# EAGLE design carteArduino (EAGLE 6.3)
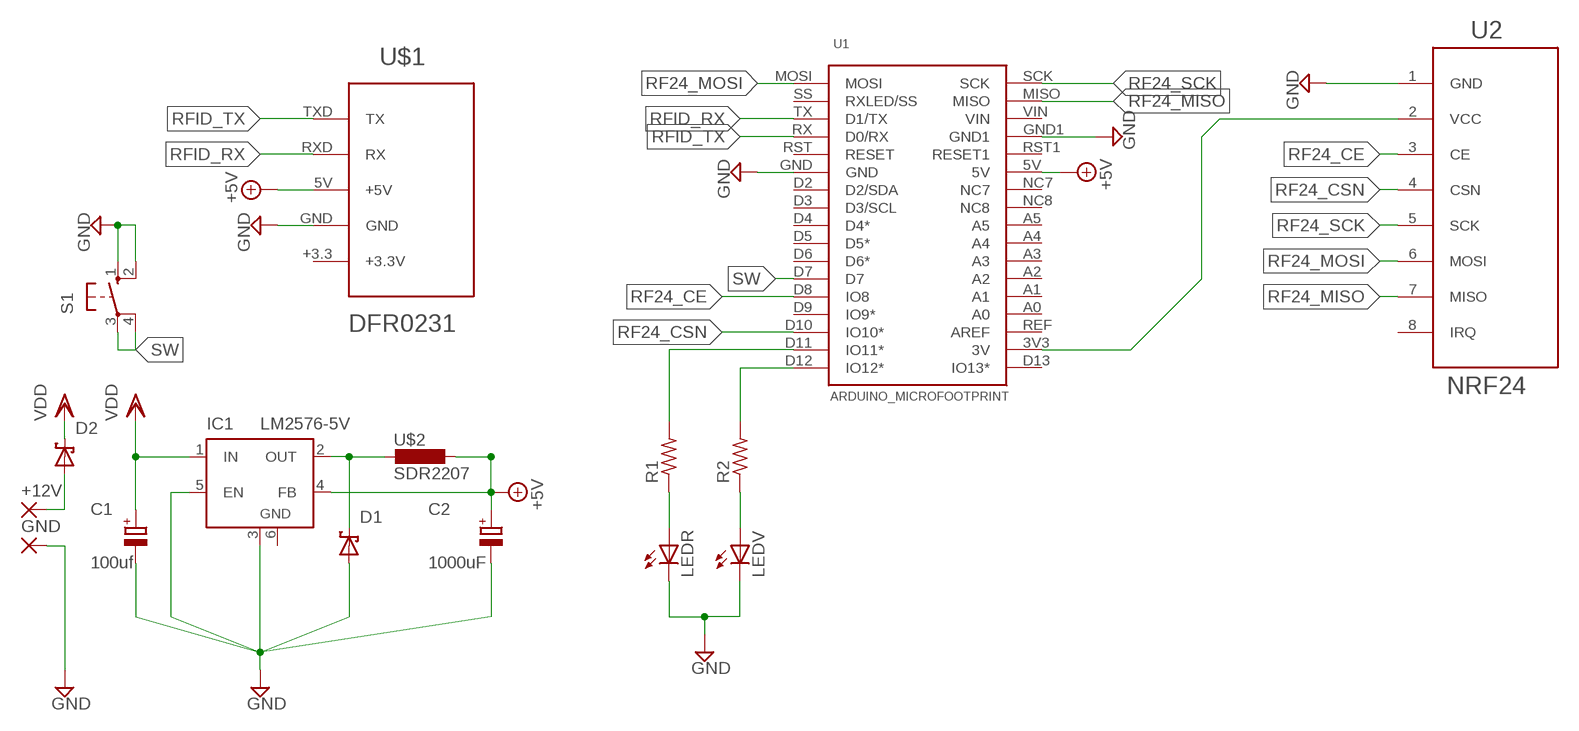
[diagram p0: schematic, sheet 1]

## Parts
+12V  3,81/1,4  [3,81/1,4]
C1  100uf  CPOL-EUE  [PANASONIC_E]
C2  1000uF  CPOL-EUG  [PANASONIC_G]
D1  SCHOTTKY-DIODESMC  [SMC]
D2  SCHOTTKY-DIODESMC  [SMC]
GND  3,81/1,4  [3,81/1,4]
IC1  LM2576-5V  LM2596S  [TO263-5]
LEDR  LED3MM  [LED3MM]
LEDV  LED3MM  [LED3MM]
R1  R-US_R1206  [R1206]
R2  R-US_R1206  [R1206]
S1  40-XX  [B3F-40XX]
U1  ARDUINO_MICROFOOTPRINT  [ARDUINO-MICRO]
U2  NRF24  [NRF_24_8PIN]
U$1  DFR0231  [DFR0231_5PIN_HOLES]
U$2  SDR2207  [SM]

## Nets
+5V: C2.+ IC1.4(FB) U1.5V U$1.5V(+5V) U$2.P$2
GND: C1.- C2.- D1.A GND.1(P) IC1.3(GND) IC1.5(EN) LEDR.K(C) LEDV.K(C) S1.1(S) S1.2(S1) U1.GND U1.GND1 U2.1(GND) U$1.GND
N$1: LEDR.A R1.1
N$2: LEDV.A R2.1
N$3: D1.C IC1.2(OUT) U$2.P$1
N$4: R2.2 U1.D12(IO12*)
N$5: R1.2 U1.D11(IO11*)
N$6: +12V.1(P) D2.A
N$7: U1.3V3(3V) U2.2(VCC)
RF24_CE: U1.D8(IO8) U2.3(CE)
RF24_CSN: U1.D10(IO10*) U2.4(CSN)
RF24_MISO: U1.MISO U2.7(MISO)
RF24_MOSI: U1.MOSI U2.6(MOSI)
RF24_SCK: U1.SCK U2.5(SCK)
RFID_RX: U1.TX(D1/TX) U$1.RXD(RX)
RFID_TX: U1.RX(D0/RX) U$1.TXD(TX)
SW: S1.3(P) S1.4(P1) U1.D7
VDD: C1.+ D2.C IC1.1(IN)
Unconnected: U1.A0 U1.A1 U1.A2 U1.A3 U1.A4 U1.A5 U1.D2(D2/SDA) U1.D3(D3/SCL) U1.D4(D4*) U1.D5(D5*) U1.D6(D6*) U1.D9(IO9*) U1.D13(IO13*) U1.NC7 U1.NC8 U1.REF(AREF) U1.RST1(RESET1) U1.RST(RESET) U1.SS(RXLED/SS) U1.VIN U2.8(IRQ) U$1.+3.3(+3.3V)

## Power pins joined to a net without a drawn wire
GND: IC1.6(GND)

## Library data of the parts
+12V GND = wirepad:3,81/1,4: THROUGH-HOLE PAD
C1 C2 = rcl:CPOL-EU: POLARIZED CAPACITOR, European symbol
D1 D2 = diode:SCHOTTKY-DIODE: Schottky Diode
IC1 = linear:LM2596S: STEP-DOWN VOLTAGE REGULATOR
LEDR LEDV = adafruit:LED: LED OSRAM: - CHIPLED LG R971, LG N971, LY N971, LG Q971, LY Q971, LO R971, LY R971 LH N974, LH R974 LS Q976, LO Q976, LY Q976 LO Q996 - Hyper CHIPLED LW Q18S LB Q993, LB Q99A, LB R99A - SideLED LS A670, LO A670, LY A670, LG A670, LP A670 LB A673, LV A673, LT A673, LW A673 LH A674 LY A675 LS A676, LA A676, LO A676, LY A676, LW A676 LS A679, LY A679, LG A679 - Hyper Micro SIDELED® LS Y876, LA Y876, LO Y876, LY Y876 LT Y87S - SmartLED LW L88C, LW L88S LB L89C, LB L89S, LG L890 LS L89K, LO L89K, LY L89K LS L896, LA L896, LO L896, LY L896 - TOPLED LS T670, LO T670, LY T670, LG T670, LP T670 LSG T670, LSP T670, LSY T670, LOP T670, LYG T670 LG T671, LOG T671, LSG T671 LB T673, LV T673, LT T673, LW T673 LH T674 LS T676, LA T676, LO T676, LY T676, LB T676, LH T676, LSB T676, LW T676 LB T67C, LV T67C, LT T67C, LS T67K, LO T67K, LY T67K, LW E67C LS E67B, LA E67B, LO E67B, LY E67B, LB E67C, LV E67C, LT E67C LW T67C LS T679, LY T679, LG T679 LS T770, LO T770, LY T770, LG T770, LP T770 LB T773, LV T773, LT T773, LW T773 LH T774 LS E675, LA E675, LY E675, LS T675 LS T776, LA T776, LO T776, LY T776, LB T776 LHGB T686 LT T68C, LB T68C - Hyper Mini TOPLED® LB M676 - Mini TOPLED Santana® LG M470 LS M47K, LO M47K, LY M47K Source: http://www.osram.convergy.de/
R1 R2 = adafruit (2):R-US_: RESISTOR, American symbol
S1 = adafruit:40-XX: OMRON SWITCH; MF: OMRON COMPONENTS USA; MPN: B3F-4000; OC_FARNELL: 176434; OC_NEWARK: 36K3105
U1 = arduino-micro:ARDUINO_MICRO
U2 = lib:NRF24
U$1 = lib:DFR0231
U$2 = bourns-inductor:SDR2207

## Board
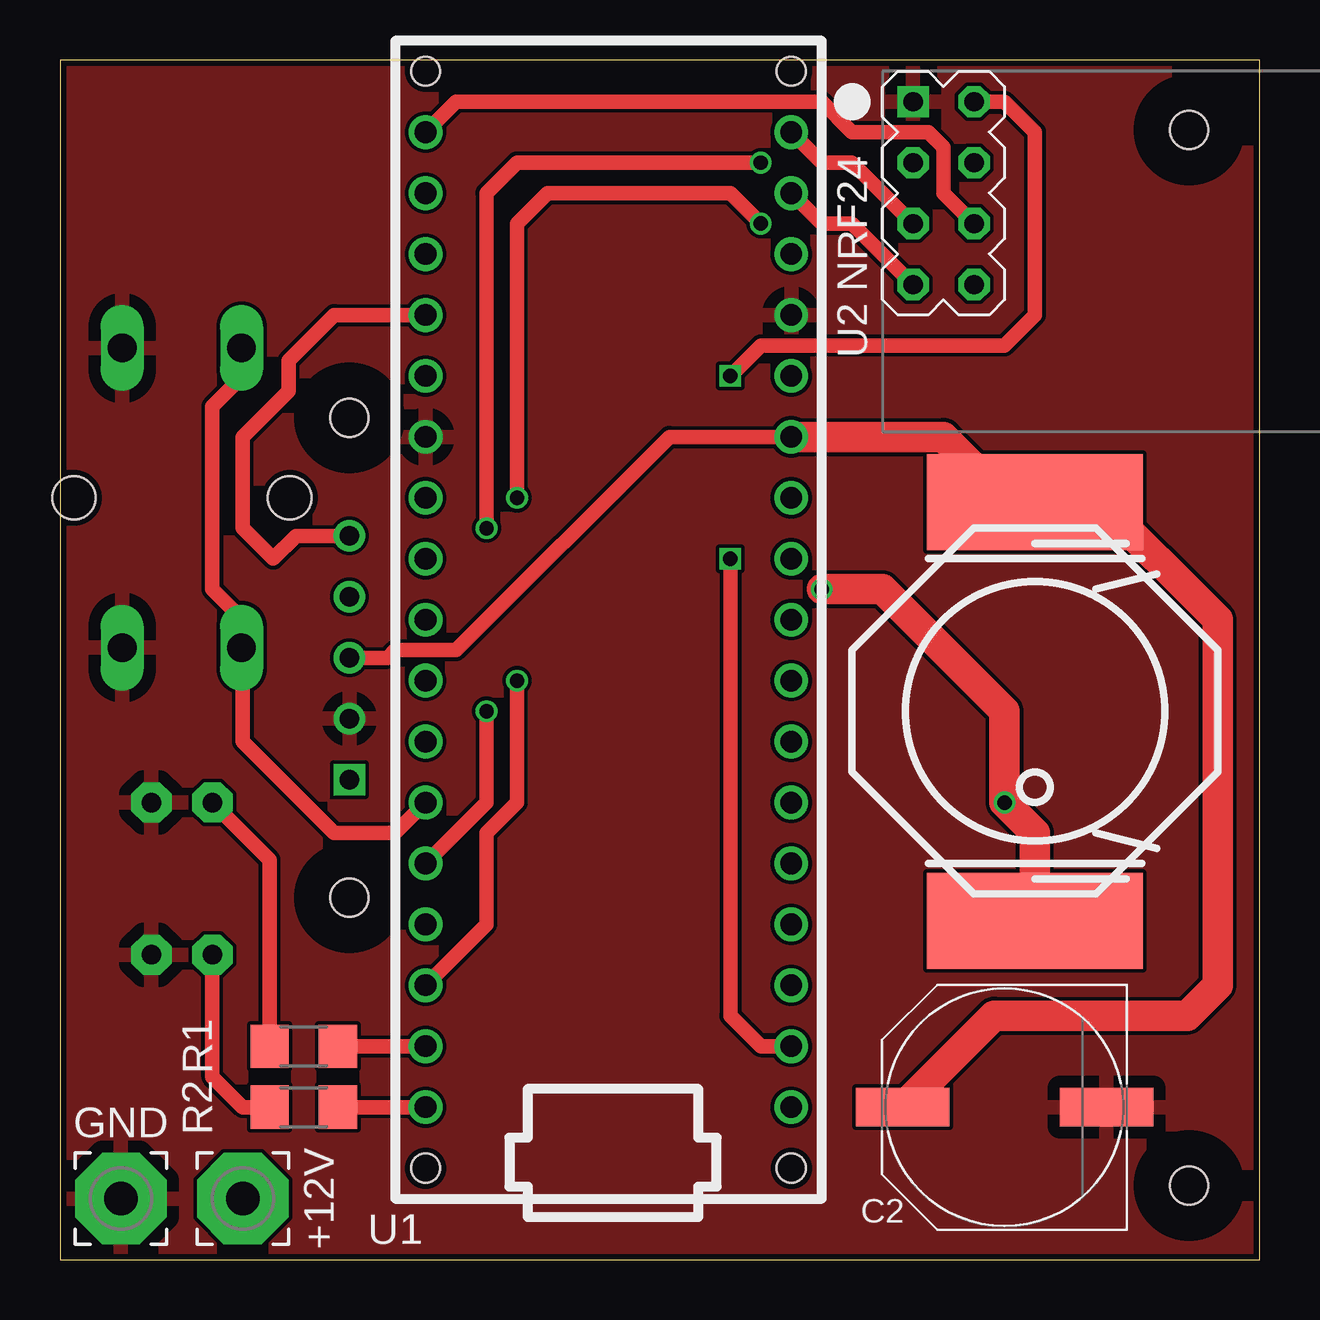
[diagram p1: board, top side]
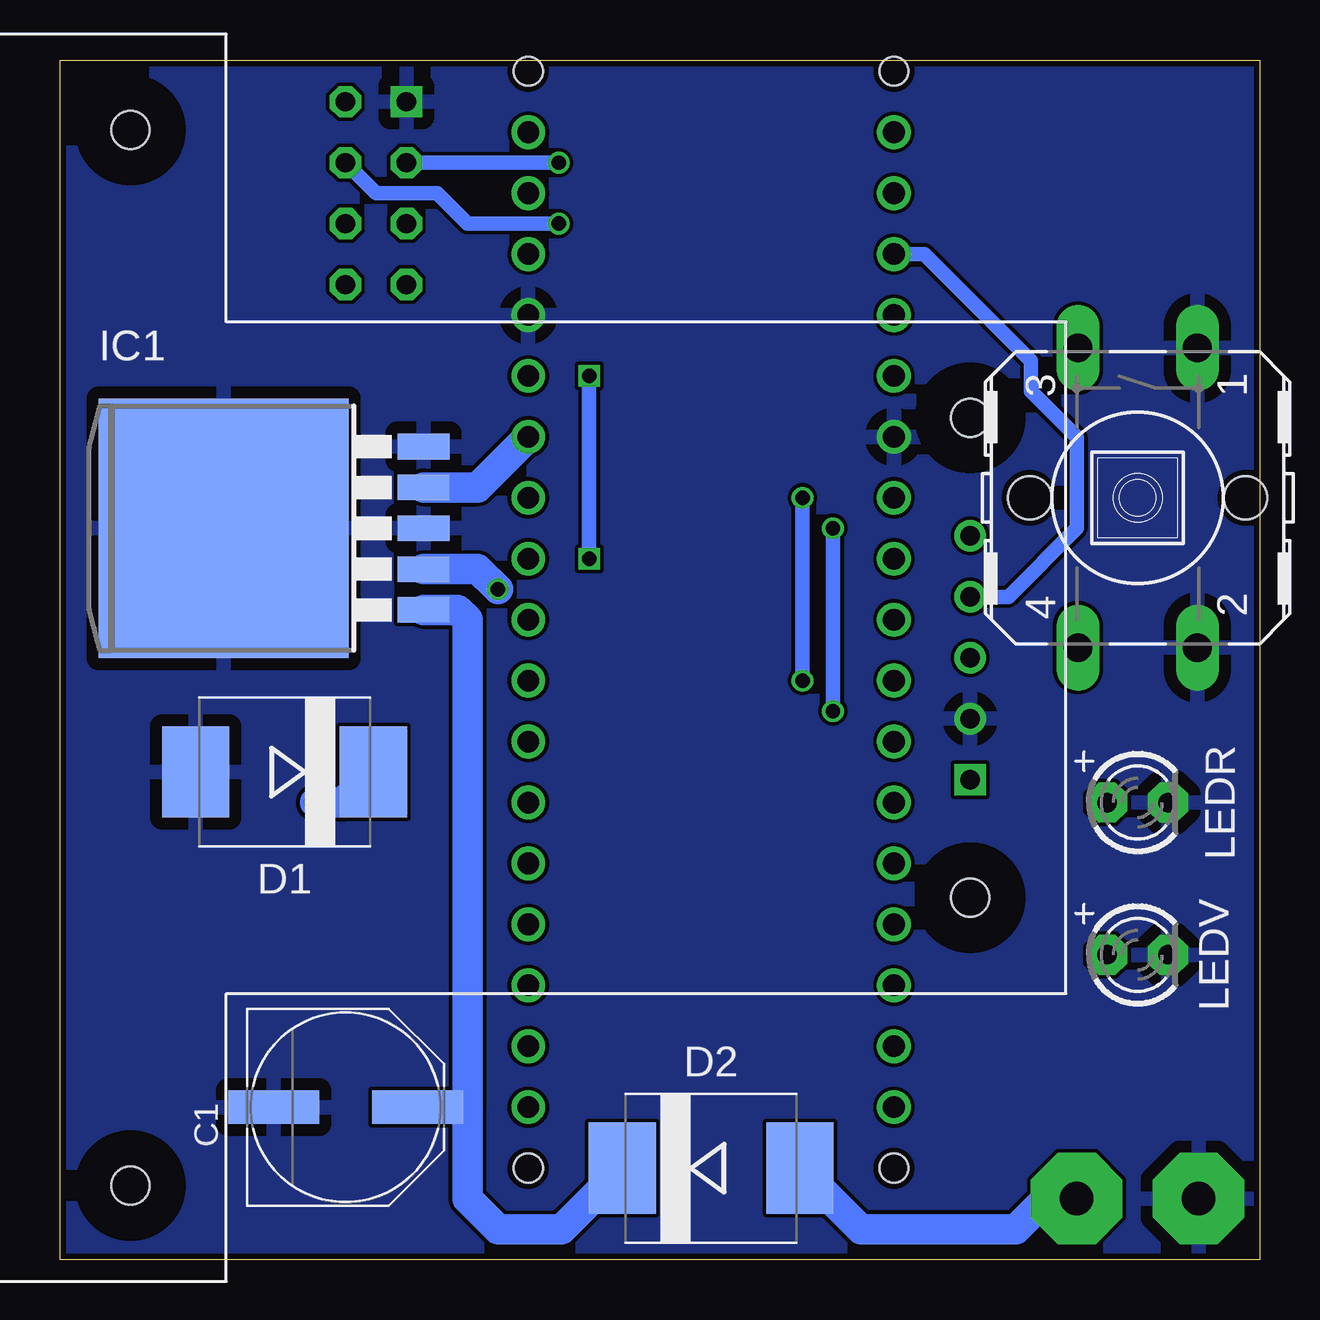
[diagram p2: board, bottom side, seen from below]

Size 50 x 50 mm. Coordinates in mm from the lower left corner, seen from the top.
Outline: 0,0 50,0 50,50 0,50 0,0
Copper layers (1*16): Top 0.035mm / dielectric 1.5mm / Bottom 0.035mm
Design rules "ITEADstudio_DRC_restrict": minimum track width 6mil, minimum drill 12mil, track to track 6mil, track to pad 6mil, pad to pad 6mil, via to via 6mil, smd to smd 0mil, copper to edge 10mil, drill to drill 10mil, minimum pad ring 10mil, minimum via ring 6mil, stop-mask expansion 2mil, vias tented up to drill 100mil, thermal gap 20mil

### Footprints (pad centres in the part's own frame; a part is rotated, then mirrored left to right if it is on the bottom)
3,81/1,4 = drill 1.397 pad 3.81 octagon: 1 0,0
PANASONIC_E = smd 3.8 x 1.4: + 3,0; - -3,0
PANASONIC_G = smd 3.9 x 1.6: + 4.25,0; - -4.25,0
SMC = smd 2.8 x 3.8: A 3.7,0; C -3.7,0
TO263-5 = smd 1.067 x 2.159: 1 -3.404,-5.791; 2 -1.702,-5.791; 3 0,-5.791; 4 1.702,-5.791; 5 3.404,-5.791 | smd 10.8 x 10.41: 6 0,2.54
LED3MM = drill 0.813 pad 1.676 octagon: A -1.27,0; K 1.27,0
R1206 = smd 1.6 x 1.803: 1 -1.422,0; 2 1.422,0
B3F-40XX = drill 1.194 long: 1 -6.248,2.489; 2 6.248,2.489; 3 -6.248,-2.489; 4 6.248,-2.489 | hole 1.803: 0,-4.496; 0,4.496
ARDUINO-MICRO = drill 0.9: 3V3 16.51,3.81; 5V 16.51,29.21; A0 16.51,8.89; A1 16.51,11.43; A2 16.51,13.97; A3 16.51,16.51; A4 16.51,19.05; A5 16.51,21.59; D2 1.27,26.67; D3 1.27,24.13; D4 1.27,21.59; D5 1.27,19.05; D6 1.27,16.51; D7 1.27,13.97; D8 1.27,11.43; D9 1.27,8.89; D10 1.27,6.35; D11 1.27,3.81; D12 1.27,1.27; D13 16.51,1.27; GND 1.27,29.21; GND1 16.51,34.29; MISO 16.51,39.37; MOSI 1.27,41.91; NC7 16.51,26.67; NC8 16.51,24.13; REF 16.51,6.35; RST 1.27,31.75; RST1 16.51,31.75; RX 1.27,34.29; SCK 16.51,41.91; SS 1.27,39.37; TX 1.27,36.83; VIN 16.51,36.83 | hole 1.2: 1.27,-1.27; 16.51,-1.27; 1.27,44.45; 16.51,44.45
NRF_24_8PIN = drill 0.8 square: 1 1.27,-3.81 | drill 0.8 octagon: 2 -1.27,-3.81; 3 1.27,-1.27; 4 -1.27,-1.27; 5 1.27,1.27; 6 -1.27,1.27; 7 1.27,3.81; 8 -1.27,3.81
DFR0231_5PIN_HOLES = drill 0.8: 5V 0,0; GND 0,2.54; RXD 0,-2.54; TXD 0,-5.08 | drill 0.8 square: +3.3 0,5.08 | hole 1.6: 0,10; 0,-10; 35,22; 35,-22
SM = smd 4 x 9: P$1 -8.74,0; P$2 8.72,0

### Placement (x,y rotation side)
+12V  7.62,2.54 0 top
C1  38.1,6.35 0 bottom
C2  39.37,6.35 180 top
D1  40.64,20.32 180 bottom
D2  22.86,3.81 0 bottom
GND  2.54,2.54 0 top
IC1  40.64,30.48 90 bottom
LEDR  5.08,19.05 0 bottom
LEDV  5.08,12.7 0 bottom
R1  10.16,8.89 0 top
R2  10.16,6.35 0 top
S1  5.08,31.75 270 bottom
U1  13.97,5.08 0 top
U2  36.83,44.45 180 top
U$1  12.06,25.08 180 bottom
U$2  40.64,22.86 90 top

### Tracks (layer width: path | path; a pad name or v marks a point on that pad's centre or on a via)
+5V
  Top 0.61: U$1.5V 13.65,25.08 13.97,25.4 16.51,25.4 25.4,34.29 U1.5V
  Top 1.27: C2.+ 38.93,10.16 46.99,10.16 48.26,11.43 48.26,26.67 43.18,31.75 43.01,31.58 U$2.P$2 40.47,31.75 39.37,31.75 36.83,34.29 U1.5V
  Bottom 1.27: IC1.4 32.59,32.18 U1.5V
GND
  pour Bottom: -1.27,50.8 53.34,50.8 53.34,-1.27 -1.27,-1.27
  pour Top: -2.54,52.07 50.8,52.07 50.8,-2.54 -2.54,-2.54
N$1
  Top 0.61: R1.1 8.74,16.66 LEDR.A
N$2
  Top 0.61: R2.1 7.62,6.35 6.35,7.62 LEDV.A
N$3  (via drill 0.6)
  Top 1.27: v31.75,27.94 34.29,27.94 39.37,22.86 v39.37,19.05 40.64,17.78 U$2.P$1
  Bottom 1.27: IC1.2 32.59,28.78 v31.75,27.94 | v39.37,19.05 38.21,19.05 D1.C
N$4
  Top 0.61: U1.D12 R2.2
N$5
  Top 0.61: R1.2 U1.D11
N$6
  Bottom 1.27: +12V.1 8.89,2.54 10.16,1.27 16.62,1.27 D2.A
N$7  (via drill 0.6)
  Top 0.61: U2.2 39.37,48.26 40.64,46.99 40.64,39.37 39.37,38.1 29.21,38.1 v27.94,36.83 | v27.94,29.21 27.94,10.16 29.21,8.89 U1.3V3
  Bottom 0.61: v27.94,36.83 v27.94,29.21
RF24_CE  (via drill 0.6)
  Top 0.61: v29.21,45.72 19.05,45.72 17.78,44.45 v17.78,30.48 | v17.78,22.86 17.78,19.05 U1.D8
  Bottom 0.61: U2.3 v29.21,45.72 | v17.78,30.48 v17.78,22.86
RF24_CSN  (via drill 0.6)
  Top 0.61: U1.D10 17.78,13.97 17.78,17.78 19.05,19.05 v19.05,24.13 | v19.05,31.75 19.05,43.18 20.32,44.45 27.94,44.45 v29.21,43.18
  Bottom 0.61: v19.05,24.13 v19.05,31.75 | v29.21,43.18 33.02,43.18 34.29,44.45 36.83,44.45 U2.4
RF24_MISO
  Top 0.61: U1.MISO 31.75,43.18 33.02,43.18 U2.7
RF24_MOSI
  Top 0.61: U2.6 36.83,44.45 36.83,46.35 36.2,46.99 33.02,46.99 31.75,48.26 16.51,48.26 U1.MOSI
RF24_SCK
  Top 0.61: U1.SCK 31.75,45.72 33.02,45.72 U2.5
RFID_RX
  Bottom 0.61: U1.TX 13.97,41.91 9.53,37.47 9.53,36.2 7.62,34.29 7.62,30.48 10.48,27.62 U$1.RXD
RFID_TX
  Top 0.61: U1.RX 11.43,39.37 9.53,37.47 9.53,36.2 7.62,34.29 7.62,30.48 8.89,29.21 9.84,30.16 U$1.TXD
SW
  Top 0.61: S1.3 7.57,36.78 6.35,35.56 6.35,27.94 7.57,26.72 S1.4 7.62,25.45 7.62,21.59 11.43,17.78 13.97,17.78 U1.D7
VDD
  Bottom 1.27: 34.29,6.35 C1.+ 33.02,6.35 | IC1.1 33.43,27.08 33.02,26.67 33.02,6.35 | 33.02,6.35 33.02,2.54 31.75,1.27 29.1,1.27 D2.C